# EAGLE design Sound_JQ6500_4 (EAGLE 9.5.2)
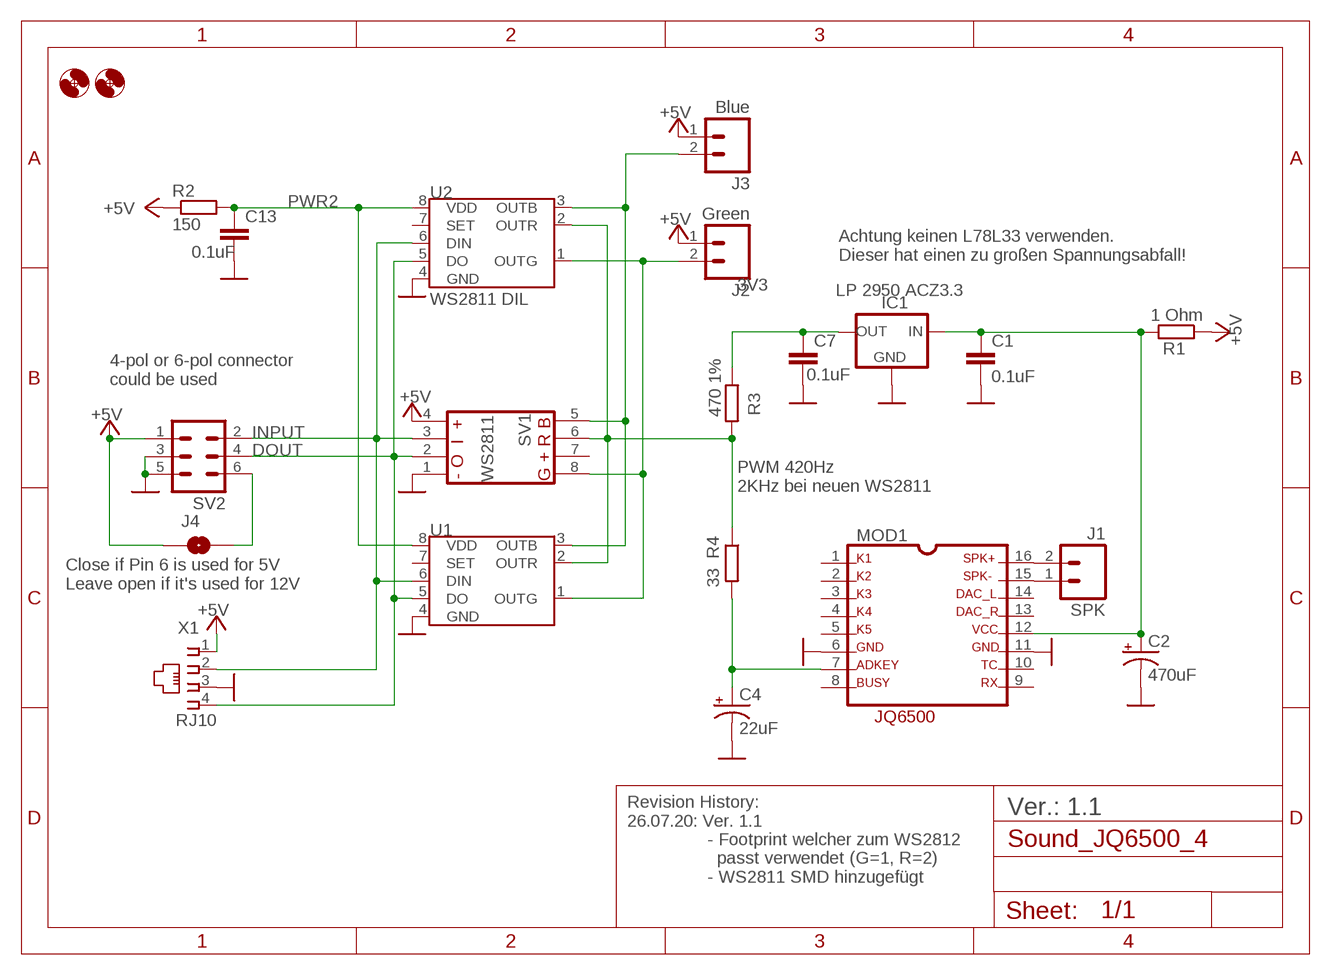
[diagram p0: schematic, sheet 1]

## Parts
C1  0.1uF  0.1UF-50V-20%(PTH)KIT-EZ  [CAP-PTH-SMALL-KIT]
C2  470uF  SPARKFUN-CAPACITORS_100UF-25V-20%(PTH)  [SPARKFUN-CAPACITORS_CPOL-RADIAL-100UF-25V]
C4  22uF  CAPACITORS_22UF  [CAPACITOR_CPOL-RADIAL-22UF]
C7  0.1uF  0.1UF-50V-20%(PTH)KIT-EZ  [CAP-PTH-SMALL-KIT]
C13  0.1uF  0.1UF-50V-20%(PTH)KIT-EZ  [CAP-PTH-SMALL-KIT]
H1  MOUNT-HOLE3.0  [3,0]
H3  MOUNT-HOLE3.0  [3,0]
IC1  LP 2950 ACZ3.3  78LXX  [78LXX]
J1  SPK  M02PTH  [1X02]
J2  Green  M02PTH  [1X02]
J3  Blue  M02PTH  [1X02]
J4  SOLDERJUMPERNO  [SJ_2S-NO]
MOD1  JQ6500  [JQ6500]
R1  1 Ohm  RCL_R-EU_0204/5  [RCL_0204/5]
R2  150  RCL_R-EU_0204/5  [RCL_0204/5]
R3  470 1%  RCL_R-EU_0204/5  [RCL_0204/5]
R4  33  RCL_R-EU_0204/5  [RCL_0204/5]
SV1  S3PO_MODUL_WS2811_SOUND_MP3-TF-16P_WS2811_AND_ATTINY_PUSHBUTTONACTION_4017_2_WS28115V  [S3PO_MODUL_WS2811_SOUND_MP3-TF-16P_WS2811_AND_ATTINY_PUSHBUTTONACTION_4017_2_WS2811_WS2811_5V]
SV2  ML6  [ML6]
U1  WS2811 DIL  S3PO_MODUL_WS2811_SOUND_MP3-TF-16P_WS2811_AND_ATTINY_WS2811-ICSOP8  [SOP8]
U2  WS2811 DIL  S3PO_MODUL_WS2811_SOUND_MP3-TF-16P_WS2811_AND_ATTINY_WS2811-ICTINY45-20-DIP  [S3PO_MODUL_WS2811_SOUND_MP3-TF-16P_WS2811_AND_ATTINY_WS2811_DIP08]
X1  RJ10  [RJ10]

## Nets
3V3: C7.1 IC1.OUT R3.1
+5V: J2.1 J3.1 J4.1 R1.1 R2.1 SV1.4(GND) SV2.1 X1.1
B2: J3.2 SV1.5(OUTG) U1.3(OUTB) U2.3(OUTB)
DOUT: SV1.2(DIN) SV2.4 U1.5(DO) U2.5(DO) X1.4
G2: J2.2 SV1.8(OUTB) U1.1(OUTG) U2.1(OUTG)
GND: C1.2 C2.2(-) C4.2(-) C7.2 C13.2 IC1.GND MOD1.6 MOD1.11 SV1.1(VDD) SV2.3 SV2.5 U1.4(GND) U2.4(GND) X1.3
INPUT: SV1.3(DO) SV2.2 U1.6(DIN) U2.6(DIN) X1.2
N$1: J1.1 MOD1.15
N$2: J1.2 MOD1.16
N$3: C1.1 C2.1(+) IC1.IN MOD1.12 R1.2
N$4: J4.2 SV2.6
N$7: C4.1(+) MOD1.7 R4.2
PWR2: C13.1 R2.2 U1.8(VDD) U2.8(VDD)
R1: R3.2 R4.1 SV1.6(OUT+) U1.2(OUTR) U2.2(OUTR)
Unconnected: MOD1.1 MOD1.2 MOD1.3 MOD1.4 MOD1.5 MOD1.8 MOD1.9 MOD1.10 MOD1.13 MOD1.14 SV1.7(OUTR) U1.7(SET) U2.7(SET)

## Notes on the sheet
- Achtung keinen L78L33 verwenden.
  Dieser hat einen zu großen Spannungsabfall!
- 4-pol or 6-pol connector
  could be used
- PWM 420Hz
  2KHz bei neuen WS2811
- Close if Pin 6 is used for 5V
  Leave open if it's used for 12V
- Revision History:
  26.07.20: Ver. 1.1
                  - Footprint welcher zum WS2812 
                    passt verwendet (G=1, R=2)
                  - WS2811 SMD hinzugefügt
- Ver.: 1.1

## Library data of the parts
C1 C7 C13 = SparkFun-Capacitors:0.1UF-50V-20%(PTH): CAP-08370; PROD_ID: CAP-08370
C2 = Sound_MP3-TF-16P_and_WS2811:SPARKFUN-CAPACITORS_100UF-25V-20%(PTH): CAP-08439; PROD_ID: CAP-08439
C4 = Sound_MP3-TF-16P_WS2811_and_ATTiny:CAPACITORS_22UF: CAP-08439; PROD_ID: CAP-08439
H1 H3 = holes:MOUNT-HOLE: MOUNTING HOLE with drill center marker
IC1 = v-reg-3:78LXX: VOLTAGE REGULATOR
J1-J3 = SparkFun-Connectors:M02: Standard 2-pin 0.1" header. Use with - straight break away headers ( PRT-00116) - right angle break away headers (PRT-00553) - swiss pins (PRT-00743) - machine pins (PRT-00117) - female headers (PRT-00115) Molex polarized connector foot print use with: PRT-08233 with associated crimp pins and housings. 2.54_SCREWTERM for use with PRT-10571. 3.5mm Screw Terminal footprints for PRT-08084 5mm Screw Terminal footprints for use with PRT-08432
J4 = SparkFun-Retired:SOLDERJUMPER: Solder Jumper Standard SMD solder jumper. Used to automate production. Two varients : Normally Open and Normally Closed are the same, but have different paste layers. NC will have a large amount of paste and should jumper during reflow.
MOD1 = Sound_JQ6500:JQ6500: MP3-TF-16P http://www.electronicoscaldas.com/datasheet/DFR0299-DFPlayer-Mini-Manual.pdf; OC_FARNELL: unknown; OC_NEWARK: unknown
R1-R4 = Sound_MP3-TF-16P_and_WS2811:RCL_R-EU_: RESISTOR, European symbol; SPICEPREFIX: R
SV1 = S3PO_Modul_WS2811:S3PO_MODUL_WS2811_SOUND_MP3-TF-16P_WS2811_AND_ATTINY_PUSHBUTTONACTION_4017_2_WS2811: Modified by Hardi
SV2 = con-harting-ml:ML6: HARTING; OC_FARNELL: unknown; OC_NEWARK: unknown
U1 = S3PO_Modul_WS2811:S3PO_MODUL_WS2811_SOUND_MP3-TF-16P_WS2811_AND_ATTINY_WS2811-IC: Die Pin Nummern für R und G sind getauscht damit sie gleich angesteuert werden wie die WS2812. Der Daten Strom der WS2811 ist RGB, Beim WS2812 ist es aber GRB.
U2 = S3PO_Modul_WS2811:S3PO_MODUL_WS2811_SOUND_MP3-TF-16P_WS2811_AND_ATTINY_WS2811-IC: Die Pin Nummern für R und G sind getauscht damit sie gleich angesteuert werden wie die WS2812. Der Daten Strom der WS2811 ist RGB, Beim WS2812 ist es aber GRB.; PROD_ID: IC-09439; VALUE: TINY45-20-DIP
X1 = RJ10:RJ10: RJ10 Connector "C:\Dat\Märklin\Schaltpläne\Allgemein\RJ10_Stecker_Layout.docx" https://de.aliexpress.com/item/100-pcs-lot-RJ11-Grau-4P4-Telefon-Buchse-4P4C-Telefon-Halter-RJ10-Telefon-Halter-PCB-Empf/32951511491.html?spm=a2g0x.search0604.3.106.53184c516NAPTE&transAbTest=ae803_4&ws_ab_test=searchweb0_0%2Csearchweb201602_3_10065_10068_10547_319_317_10548_10696_10084_453_10083_454_10618_10304_10307_10820_10821_537_10302_536_10902_10843_10059_10884_10887_321_322_10103%2Csearchweb201603_57%2CppcSwitch_0&algo_pvid=cf281ae9-d22a-4418-b1b2-d9dd3eca3a16&algo_expid=cf281ae9-d22a-4418-b1b2-d9dd3eca3a16-15; OC_FARNELL: unknown; OC_NEWARK: unknown

## Board
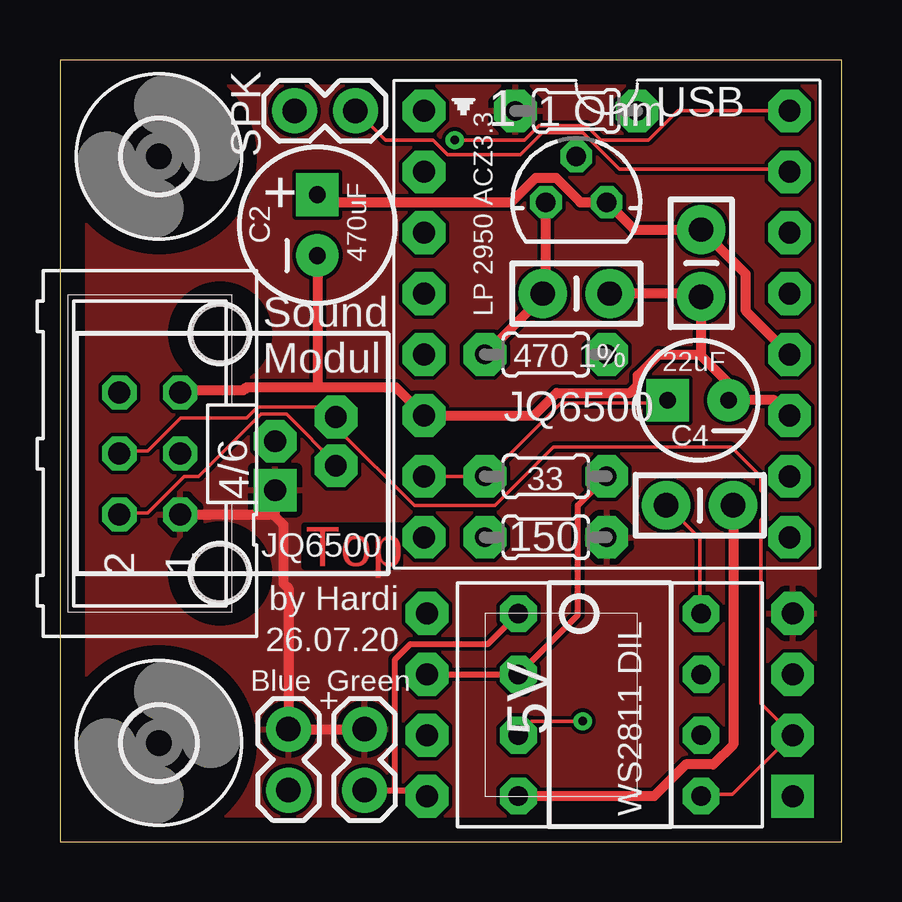
[diagram p1: board, top side]
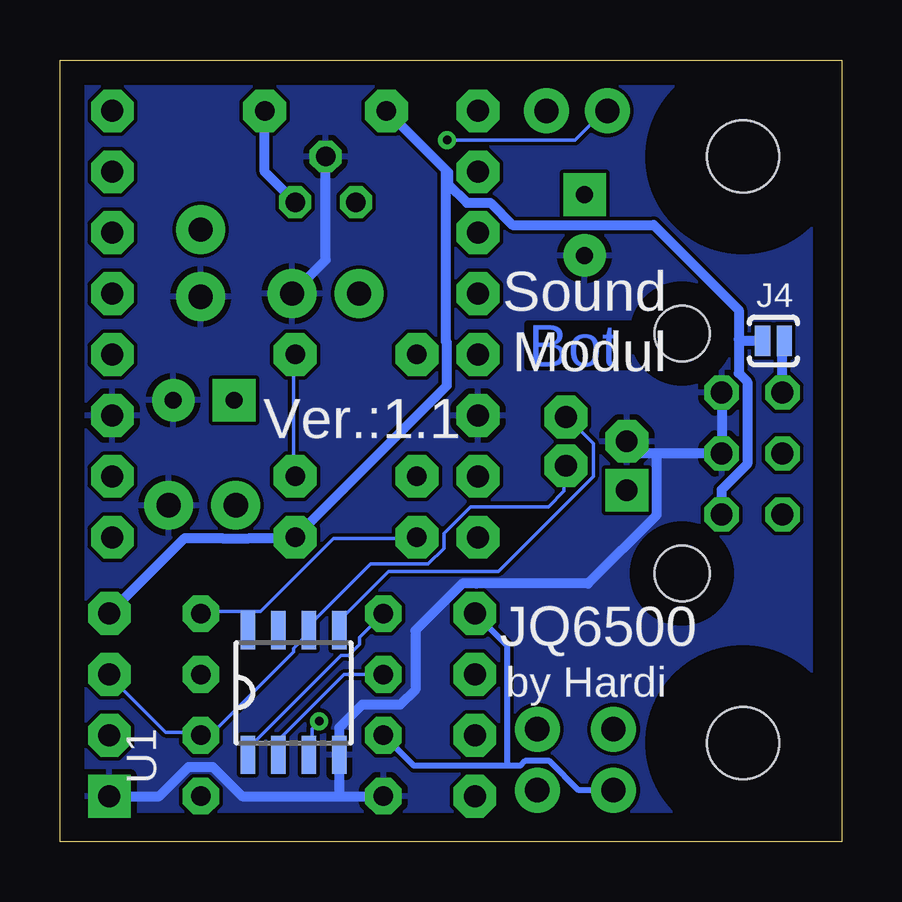
[diagram p2: board, bottom side, seen from below]

Size 32.6 x 32.6 mm. Coordinates in mm from the lower left corner, seen from the top.
Outline: 0,0 32.6,0 32.6,32.6 0,32.6 0,0
Copper layers (1*16): Top 0.035mm / dielectric 1.5mm / Bottom 0.035mm
Design rules "default *": minimum track width 6mil, minimum drill 0.35mm, track to track 6mil, track to pad 6mil, pad to pad 6mil, via to via 6mil, smd to smd 6mil, copper to edge 40mil, drill to drill 6mil, minimum pad ring 10mil, minimum via ring 8mil, stop-mask expansion 4mil, vias tented up to drill 0mil, thermal gap 10mil

### Footprints (pad centres in the part's own frame; a part is rotated, then mirrored left to right if it is on the bottom)
CAP-PTH-SMALL-KIT = drill 1.016 pad 2.032: 1 -1.397,0; 2 1.397,0
SPARKFUN-CAPACITORS_CPOL-RADIAL-100UF-25V = drill 0.7 pad 1.778 square: 1 1.27,0 | drill 0.7 pad 1.778: 2 -1.27,0
CAPACITOR_CPOL-RADIAL-22UF = drill 0.7 pad 1.778 square: 1 1.27,0 | drill 0.7 pad 1.778: 2 -1.27,0
3,0 = hole 3: 0,0
78LXX = drill 0.813 octagon: GND 0,1.905; IN 1.27,0; OUT -1.27,0
1X02 = drill 1.016 pad 1.88: 1 0,0; 2 2.54,0
SJ_2S-NO = smd 0.635 x 1.27: 1 -0.45,0; 2 0.45,0
JQ6500 = drill 0.914 pad 1.778 octagon: 1 -8.89,16.51; 2 -8.89,13.97; 3 -8.89,11.43; 4 -8.89,8.89; 5 -8.89,6.35; 6 -8.89,3.81; 7 -8.89,1.27; 8 -8.89,-1.27; 9 6.35,-1.27; 10 6.35,1.27; 11 6.35,3.81; 12 6.35,6.35; 13 6.35,8.89; 14 6.35,11.43; 15 6.35,13.97; 16 6.35,16.51
RCL_0204/5 = drill 0.813 pad 1.778 octagon: 1 -2.54,0; 2 2.54,0
S3PO_MODUL_WS2811_SOUND_MP3-TF-16P_WS2811_AND_ATTINY_PUSHBUTTONACTION_4017_2_WS2811_WS2811_5V = drill 0.914 pad 1.778 square: 1 -5.08,-5.08 | drill 0.914 pad 1.778 octagon: 2 -2.54,-5.08; 3 0,-5.08; 4 2.54,-5.08; 5 2.54,10.16; 6 0,10.16; 7 -2.54,10.16; 8 -5.08,10.16
ML6 = drill 0.914 octagon: 1 -2.54,-1.27; 2 -2.54,1.27; 3 0,-1.27; 4 0,1.27; 5 2.54,-1.27; 6 2.54,1.27
SOP8 = smd 0.6 x 1.6: 1 -1.905,-2.6; 2 -0.635,-2.6; 3 0.635,-2.6; 4 1.905,-2.6; 5 1.905,2.6; 6 0.635,2.6; 7 -0.635,2.6; 8 -1.905,2.6
S3PO_MODUL_WS2811_SOUND_MP3-TF-16P_WS2811_AND_ATTINY_WS2811_DIP08 = drill 0.813 pad 1.524 octagon: 1 -3.81,-3.81; 2 -1.27,-3.81; 3 1.27,-3.81; 4 3.81,-3.81; 5 3.81,3.81; 6 1.27,3.81; 7 -1.27,3.81; 8 -3.81,3.81
RJ10 = drill 0.9 pad 1.778 square: 1 -1.524,-2.3 | drill 0.9 pad 1.778 octagon: 2 -0.508,-4.84; 3 0.508,-2.3; 4 1.524,-4.84 | hole 2.3: 5,0; -5,0

### Placement (x,y rotation side)
C1  26.73,24.13 270 top
C2  10.73,25.72 90 top
C4  26.61,18.41 180 top
C7  21.53,22.86 0 top
C13  26.67,14.03 0 top
H1  4.13,4.13 0 top
H3  4.13,28.57 0 top
IC1  21.53,26.67 0 top
J1  12.32,30.48 180 top
J2  12.7,4.7 270 top
J3  9.53,4.7 270 top
J4  2.86,20.89 0 bottom
MOD1  24.07,13.97 0 top
R1  21.53,30.48 0 top
R2  20.26,12.7 180 top
R3  20.26,20.32 0 top
R4  20.26,15.24 180 top
SV1  25.46,6.99 90 top
SV2  3.75,16.19 90 top
U1  22.86,6.23 0 bottom
U2  22.92,5.71 270 top
X1  6.67,16.19 90 top

### Tracks (layer width: path | path; a pad name or v marks a point on that pad's centre or on a via)
3V3
  Top 0.406: R3.1 20.13,22.73 C7.1 20.26,22.99 IC1.OUT
+5V
  Top 0.406: SV2.1 8.89,13.65 | 8.89,13.65 8.97,13.73 X1.1 | 8.89,13.65 9.31,13.23 9.31,10.79 9.53,10.57 J3.1 J2.1
  Bottom 0.152: 22.84,12.67 R2.1
  Bottom 0.406: SV2.1 5.02,14.68 3.95,15.75 3.95,19.19 4.3,19.54 4.3,20.95 | R1.1 16.51,28 | 16.51,28 16.42,27.91 16.42,27.42 15.64,26.64 14.66,26.64 13.73,25.72 7.84,25.72 4.3,22.17 4.3,20.95 | J4.1 4.24,20.89 4.3,20.95 | R2.1 16.47,19.02 16.47,20.84 16.51,20.87 16.51,28 | SV1.4 27.4,12.67 25.85,12.67 25.84,12.66 24.7,12.66 24.7,12.67 22.84,12.67
  pour Top: 0,0 31.75,0 31.75,31.75 0,31.75
B2  (via drill 0.35)
  Top 0.152: v21.79,5.03 19.66,5.03 19.2,4.57 U2.3
  Bottom 0.152: v21.79,5.03 22.1,4.72 22.1,3.66 U1.3
  Bottom 0.254: J3.2 10.98,2.16 12.2,3.38 13.21,3.38 13.41,3.17 13.97,3.17 | U2.3 17.84,3.17 13.97,3.17 | SV1.5 13.97,8.19 13.97,3.17
DOUT
  Top 0.152: U2.5 26.82,1.98 28.04,1.98 30.48,4.42 SV1.2 29.21,5.78 29.21,13.42 29.31,13.52 29.31,14.55 29.21,14.65 29.21,15.24 27.99,16.46 20.57,16.46 18.14,14.02 14.78,14.02 11.58,17.22 11.58,17.68 X1.4 11.43,17.83 11.12,18.14 8.23,18.14 7.77,17.68 5.03,17.68 3.66,16.31 2.59,16.31 SV2.4
  Bottom 0.152: U1.5 20.88,8.84 20.88,9.3 18.9,11.28 14.33,11.28 10.36,15.24 10.36,16.61 11.43,17.68 X1.4
G2
  Top 0.254: J2.2 13.97,2.16 | 13.97,2.16 15.05,2.16 SV1.8 | 13.97,2.16 13.97,7.62 14.61,8.26 17.84,8.26 U2.1
  Bottom 0.152: U1.1 24.69,3.66 24.69,3.96 20.88,7.77 20.57,7.77 20.12,8.23 20.12,8.53 19.2,9.45 U2.1
GND
  Top 0.406: C13.2 28.07,4.05 27.24,3.23 26.09,3.23 24.77,1.91 U2.4 | 26.67,20.32 26.73,20.38 C1.2 26.61,22.86 C7.2 | 26.67,20.32 24.96,20.32 24.09,19.45 24.09,19.05 23.76,18.72 20.7,18.72 19.76,17.78 MOD1.6 13.99,18.96 10.79,18.96 | MOD1.11 29.78,18.41 C4.2 27.88,19.11 26.67,20.32 | 10.79,18.96 7.79,18.96 7.65,18.82 5.11,18.82 SV2.5 | C2.2 10.73,19.02 10.79,18.96
  Bottom 0.406: SV1.1 28.46,1.91 27.24,3.12 26.23,3.12 25.01,1.91 20.95,1.91 | 20.95,1.91 U2.4 | SV2.5 SV2.3 7.62,16.19 | 7.62,16.19 8.46,16.19 X1.3 | 7.62,16.19 7.72,16.09 7.72,13.63 10.59,10.77 15.24,10.77 15.82,10.77 17.78,8.81 17.78,6.35 18.41,5.71 20,5.71 20.95,4.76 U1.4 20.95,1.91 | C7.2 21.53,24.26 IC1.GND
  pour Bottom: 1.27,1.27 31.75,1.27 31.75,31.75 1.27,31.75
INPUT
  Top 0.152: SV2.2 2.59,13.72 3.66,13.72 5.18,15.24 5.79,15.24 8.38,17.83 9.45,17.83 11.58,15.7 X1.2
  Bottom 0.152: SV1.3 30.48,6.86 28.19,4.57 26.82,4.57 U2.6 26.67,4.57 26.21,4.57 22.86,7.92 22.86,8.08 22.25,8.69 U1.6 22.1,8.84 22.1,9.14 19.66,11.58 17.25,11.58 16.6,12.24 16.6,12.86 15.49,13.97 12.24,13.97 11.58,14.63 11.58,15.54 X1.2
N$1
  Top 0.152: MOD1.15 30.33,28.04 23.32,28.04 21.79,29.57 20.12,29.57 19.2,28.65 16.15,28.65 15.54,29.26 13.56,29.26 12.34,30.48 J1.1
N$2  (via drill 0.35)
  Top 0.152: MOD1.16 25.76,30.48 24.54,29.26 22.55,29.26 21.95,29.87 19.96,29.87 19.36,29.26 v16.46,29.26
  Bottom 0.152: v16.46,29.26 11.12,29.26 9.91,30.48 J1.2
N$3
  Top 0.406: C2.1 11.05,26.67 18.82,26.67 19.84,27.69 20.68,27.69 21.69,26.67 IC1.IN 23.94,25.53 C1.1 28.57,23.69 28.57,22.16 MOD1.12
  Bottom 0.406: IC1.IN 24.07,27.94 R1.2
N$4
  Bottom 0.406: SV2.6 2.48,20.82 J4.2
N$7
  Top 0.152: MOD1.7 R4.2 17.83,15.24 20.88,18.29 25.3,18.29 C4.1
PWR2
  Top 0.152: U2.8 26.67,9.6 26.67,12.65 25.3,14.02 C13.1
  Bottom 0.152: 24.84,9.6 26.67,9.6 U2.8 | 24.84,9.6 24.23,9.6 21.18,12.65 17.83,12.65 R2.2 | 24.84,9.6 24.84,8.84 U1.8
R1
  Top 0.254: SV1.6 U2.2 21.59,9.46 21.59,14.03 R4.1
  Bottom 0.152: R3.2 22.86,20.27 22.86,15.24 R4.1 | U1.2 23.47,3.66 23.47,4.27 20.75,6.99 U2.2

### Text on the board
Top: Top
Bottom: Bot
tNames: USB | + | Sound / Modul | 4/ | JQ6500 | by Hardi | 26.07.20 | +
bNames: Sound / Modul | Ver.:1.1 | JQ6500 | by Hardi